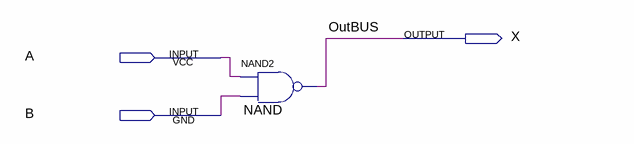
[diagram p0: schematic sheet]
// Quartus schematic Nand2sim.bdf as structural Verilog: 1 symbols, 3 pins
module Nand2sim (
  input  A,
  input  B,
  output X
);

  nand NAND (X, A, B);

  // Other names for the same wires on the sheet: OutBUS = X
endmodule
